# EAGLE design LEDs and Buttons (EAGLE 8.6.0)
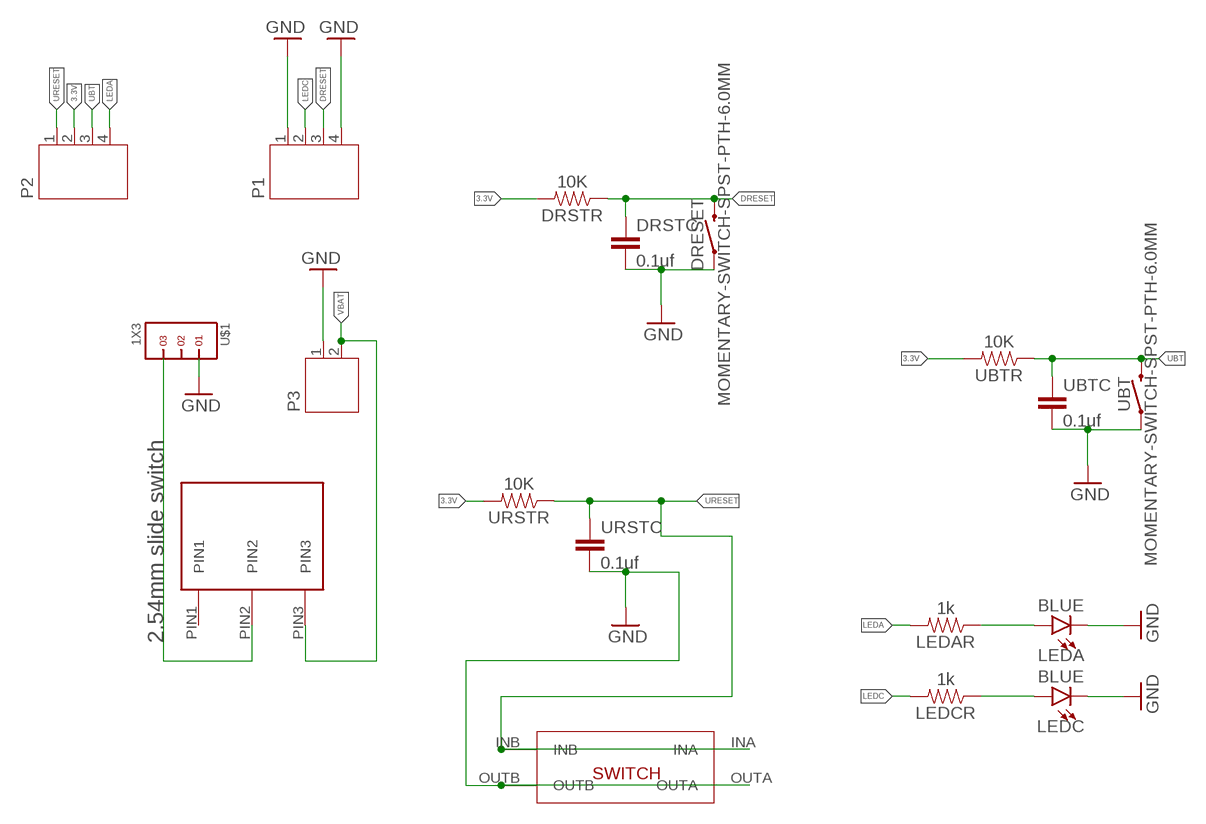
[diagram p0: schematic, sheet 1]

## Parts
DRESET  MOMENTARY-SWITCH-SPST-PTH-6.0MM  [TACTILE_SWITCH_PTH_6.0MM]
DRSTC  0.1uf  22UF-0805-6.3V-20%  [0805]
DRSTR  10K  0.75OHM-0805-1/4W-1%  [0805]
LEDA  BLUE  LED-BLUE1206  [LED-1206]
LEDAR  1k  0.75OHM-0805-1/4W-1%  [0805]
LEDC  BLUE  LED-BLUE1206  [LED-1206]
LEDCR  1k  0.75OHM-0805-1/4W-1%  [0805]
P1  JST-PH4  [JST-PH4]
P2  JST-PH4  [JST-PH4]
P3  JST-PH2  [JST-PH2]
U$1  1X3  [1X3]
U$2  4X4X1.5_SMD_SWITCH  [4X4X1.5_SMD_SWITCH]
U$14  TS02_SWITCH  [TS02_SWITCH]
UBT  MOMENTARY-SWITCH-SPST-PTH-6.0MM  [TACTILE_SWITCH_PTH_6.0MM]
UBTC  0.1uf  22UF-0805-6.3V-20%  [0805]
UBTR  10K  0.75OHM-0805-1/4W-1%  [0805]
URSTC  0.1uf  22UF-0805-6.3V-20%  [0805]
URSTR  10K  0.75OHM-0805-1/4W-1%  [0805]

## Nets
3.3V: DRSTR.2 P2.2 UBTR.2 URSTR.2
DRESET: DRESET.3 DRSTC.1 DRSTR.1 P1.3
GND: DRESET.1 DRSTC.2 LEDA.C LEDC.C P1.1 P1.4 P3.1 U$1.1 U$2.OUTA U$2.OUTB UBT.1 UBTC.2 URSTC.2
LEDA: LEDAR.2 P2.4
LEDC: LEDCR.2 P1.2
N$1: LEDC.A LEDCR.1
N$2: U$1.3 U$14.PIN2
N$4: LEDA.A LEDAR.1
UBT: P2.3 UBT.3 UBTC.1 UBTR.1
URESET: P2.1 U$2.INA U$2.INB URSTC.1 URSTR.1
VBAT: P3.2 U$14.PIN3
Unconnected: U$1.2 U$14.PIN1

## Library data of the parts
DRESET UBT = SparkFun-Switches:MOMENTARY-SWITCH-SPST: Momentary Switch (Pushbutton) - SPST Normally-open (NO) SPST momentary switches (buttons, pushbuttons). Variants PTH-12MM - 12mm square, through-hole Momentary Pushbutton Switch - 12mm Square <https://www.sparkfun.com/products/9190> (COM-09190) PTH-6.0MM, PTH-6.0MM-KIT - 6.0mm square, through-hole Mini Pushbutton Switch <https://www.sparkfun.com/products/97> (COM-00097) KIT package intended for soldering kit's - only one side of pads' copper is exposed. PTH-RIGHT-ANGLE-KIT - Right-angle, through-hole Right Angle Tactile Button <https://www.sparkfun.com/products/10791> - Used on SparkFun BigTime Watch Kit <https://www.sparkfun.com/products/11734> SMD-12MM - 12mm square, surface-mount Tactile Button - SMD (12mm) <https://www.sparkfun.com/products/12993> (COM-12993) Used on SparkFun PicoBoard <https://www.sparkfun.com/products/11888> SMD-4.5MM - 4.5mm Square Trackball Switch Used on SparkFun Blackberry Trackballer Breakout <https://www.sparkfun.com/products/13169> SMD-4.6MMX2.8MM - 4.60mm x 2.80mm, surface mount Used on SparkFun SAMD21 Mini Breakout <https://www.sparkfun.com/products/13664> SMD-5.2MM, SMD-5.2-REDUNDANT - 5.2mm square, surface-mount Mini Pushbutton Switch - SMD <https://www.sparkfun.com/products/8720> (COM-08720) Used on Arduino Pro Mini <https://www.sparkfun.com/products/11114> REDUNDANT package connects both switch circuits together SMD-6.0X3.5MM - 6.0 x 3.5mm, surface mount Momentary Reset Switch SMD <https://www.sparkfun.com/products/8229> (COM-08229) SMD-6.2MM-TALL - 6.2mm square, surface mount Tactile Button - SMD (6mm) <https://www.sparkfun.com/products/12992> Used on SparkFun Digital Sandbox <https://www.sparkfun.com/products/12651> SMD-RIGHT-ANGLE - Right-angle, surface mount Used on SparkFun Block for Intel® Edison - Arduino <https://www.sparkfun.com/products/13036>; PROD_ID: SWCH-08441; SF_SKU: COM-00097
DRSTC UBTC URSTC = SparkFun-Capacitors:22UF: 22µF ceramic capacitors A capacitor is a passive two-terminal electrical component used to store electrical energy temporarily in an electric field.; PROD_ID: CAP-08402; VALUE: 22uF
DRSTR LEDAR LEDCR UBTR URSTR = SparkFun-Resistors:0.75OHM: 0.75Ω resistor A resistor is a passive two-terminal electrical component that implements electrical resistance as a circuit element. Resistors act to reduce current flow, and, at the same time, act to lower voltage levels within circuits. - Wikipedia; PROD_ID: RES-08474; VALUE: 0.75
LEDA LEDC = SparkFun-LED:LED-BLUE: Blue SMD LED Used in manufacturing of various products at SparkFun Packages: 0603 - SMD 0603 package [Product Link] <http://www.digikey.com/product-detail/en/SMLE12BC7TT86/511-1589-2-ND/1641808> 1206 - SMD1206 package [Product Link] <http://www.digikey.com/product-detail/en/lite-on-inc/LTST-C150TBKT/160-1643-1-ND/573584> SparkFun Products: ESP8266 Thing-Dev Board <https://www.sparkfun.com/products/13711> RedBoard <https://www.sparkfun.com/products/12757>; PROD_ID: DIO-09911
P1 P2 = jst-ph:JST-PH4
P3 = jst-ph:JST-PH2
U$1 = headers(2mm):1X3
U$2 = 4X4X1.5_SMD_SWITCH:4X4X1.5_SMD_SWITCH
U$14 = 2.54mm slide switch:TS02_SWITCH

## Board
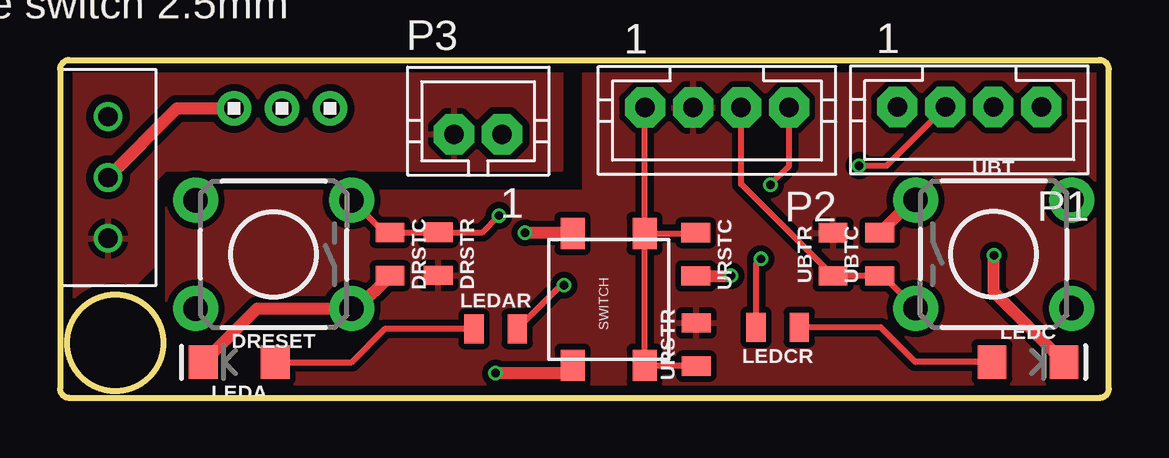
[diagram p1: board, top side]
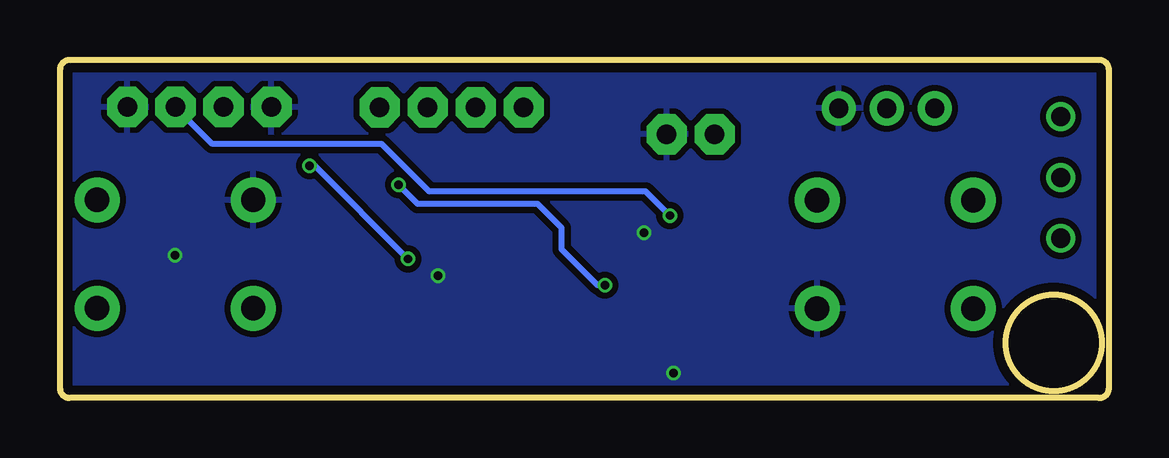
[diagram p2: board, bottom side, seen from below]

Size 43.7 x 14.1 mm. Coordinates in mm from the lower left corner, seen from the top.
Outline: 0.4,0 43.3,0 arc90 43.7,0.4 43.7,13.7 arc90 43.3,14.1 0.4,14.1 arc90 0,13.7 0,0.4 arc90 0.4,0
Outline: circle at 2.3,2.3 radius 2
Copper layers (1*16): Top 0.035559375mm / dielectric 1.6mm / Bottom 0.035559375mm
Design rules "oshpark-2layer *": minimum track width 6mil, minimum drill 10mil, track to track 6mil, track to pad 6mil, pad to pad 6mil, via to via 6mil, smd to smd 6mil, copper to edge 15mil, drill to drill 6mil, minimum pad ring 5mil, minimum via ring 5mil, stop-mask expansion 0mil, vias tented up to drill 12mil, thermal gap 10mil

### Footprints (pad centres in the part's own frame; a part is rotated, then mirrored left to right if it is on the bottom)
TACTILE_SWITCH_PTH_6.0MM = drill 1.016 pad 1.88: 1 -3.251,2.261; 2 3.251,2.261; 3 -3.251,-2.261; 4 3.251,-2.261
0805 = smd 0.8 x 1.2: 1 -0.9,0; 2 0.9,0
LED-1206 = smd 1.2 x 1.4: A -1.5,0; C 1.5,0
JST-PH4 = drill 0.813 pad 1.676 octagon: 1 3,0; 2 1,0; 3 -1,0; 4 -3,0
JST-PH2 = drill 0.813 pad 1.676 octagon: 1 1,0; 2 -1,0
1X3 = drill 0.8 pad 1.422: 1 -2,0; 2 0,0; 3 2,0
4X4X1.5_SMD_SWITCH = smd 1.3 x 1: INA -2.75,-1.5; INB 2.75,-1.5; OUTA -2.75,1.5; OUTB 2.75,1.5
TS02_SWITCH = drill 0.8: PIN1 0,2.54; PIN2 0,0; PIN3 0,-2.54

### Placement (x,y rotation side)
DRESET  8.9,5.99 180 top
DRSTC  13.75,6 270 top
DRSTR  15.76,6.01 270 top
LEDA  7.47,1.49 180 top
LEDAR  18.15,2.88 0 top
LEDC  40.33,1.5 0 top
LEDCR  29.9,2.95 180 top
P1  37.89,12.14 180 top
P2  27.38,12.12 180 top
P3  17.42,11 0 top
U$1  9.25,12.08 180 top
U$2  22.86,4.11 90 top
U$14  2,9.2 0 top
UBT  38.9,6 0 top
UBTC  34.16,5.99 90 top
UBTR  32.21,5.99 90 top
URSTC  26.49,5.99 270 top
URSTR  26.51,2.23 90 top

### Tracks (layer width: path | path; a pad name or v marks a point on that pad's centre or on a via)
3.3V
  pour Top (isolate 0.254): 21.82,17.08 21.82,8.62 4.45,8.62 4.45,-2.5 49.16,-3 49.16,17.1 21.84,17.1
DRESET  (via drill 0.35)
  Top 0.254: DRESET.3 13.5,6.9 DRSTC.1 DRSTR.1 17.59,6.91 v18.29,7.61
  Bottom 0.254: v18.29,7.61 19.3,8.62 28.32,8.62 30.3,10.6 37.35,10.6 P1.3
GND  (via drill 0.35)
  Top 0.508: LEDC.C 38.91,4.42 v38.91,5.95 | URSTC.2 v27.94,5.09 v27.95,5.1 | U$2.OUTB 21.33,6.89 v19.37,6.89 | LEDA.C 8.21,3.73 DRESET.1 12.38,3.73 DRSTC.2 | U$2.OUTA 21.03,1.03 v18.14,1.03 | UBTC.2 35.53,8.26 UBT.1
  pour Bottom (isolate 0.254): -1.5,20.51 -1.5,-3.37 49.69,-3.37 49.69,20.52 -1.53,20.52
LEDA  (via drill 0.35)
  Top 0.254: LEDAR.2 20.87,4.7 v21,4.7 | v29.6,8.9 30.38,9.68 P2.4
  Bottom 0.254: v21,4.7 21.3,4.7 22.8,6.2 22.8,7.1 23.8,8.1 28.8,8.1 v29.6,8.9
LEDC  (via drill 0.35)
  Top 0.254: LEDCR.2 29,5.6 v29.2,5.8 | v33.3,9.69 34.44,9.69 P1.2
  Bottom 0.254: v29.2,5.8 33.09,9.69 v33.3,9.69
N$1
  Top 0.254: LEDC.A 35.64,1.5 34.19,2.95 LEDCR.1
N$2
  Top 0.508: U$14.PIN2 4.88,12.08 U$1.3
N$4
  Top 0.254: LEDAR.1 13.54,2.88 12.15,1.49 LEDA.A
UBT
  Top 0.254: UBT.3 34.3,5.09 UBTC.1 UBTR.1 28.38,8.92 P2.3
URESET
  Top 0.254: U$2.INB 26.46,6.86 URSTC.1 | URSTR.1 26.48,1.36 U$2.INA U$2.INB | U$2.INB 24.36,12.1 P2.1
VBAT
  pour Top (isolate 0.305): 20.9,17 20.9,9.5 4.4,9.5 3.9,9 3.9,5.5 2.4,4 2.4,1.5 2.4,-0.5 -2.1,-0.5 -3.6,1 -3.6,16 -2.6,17